# EAGLE schematic cell (EAGLE 7.6.0)
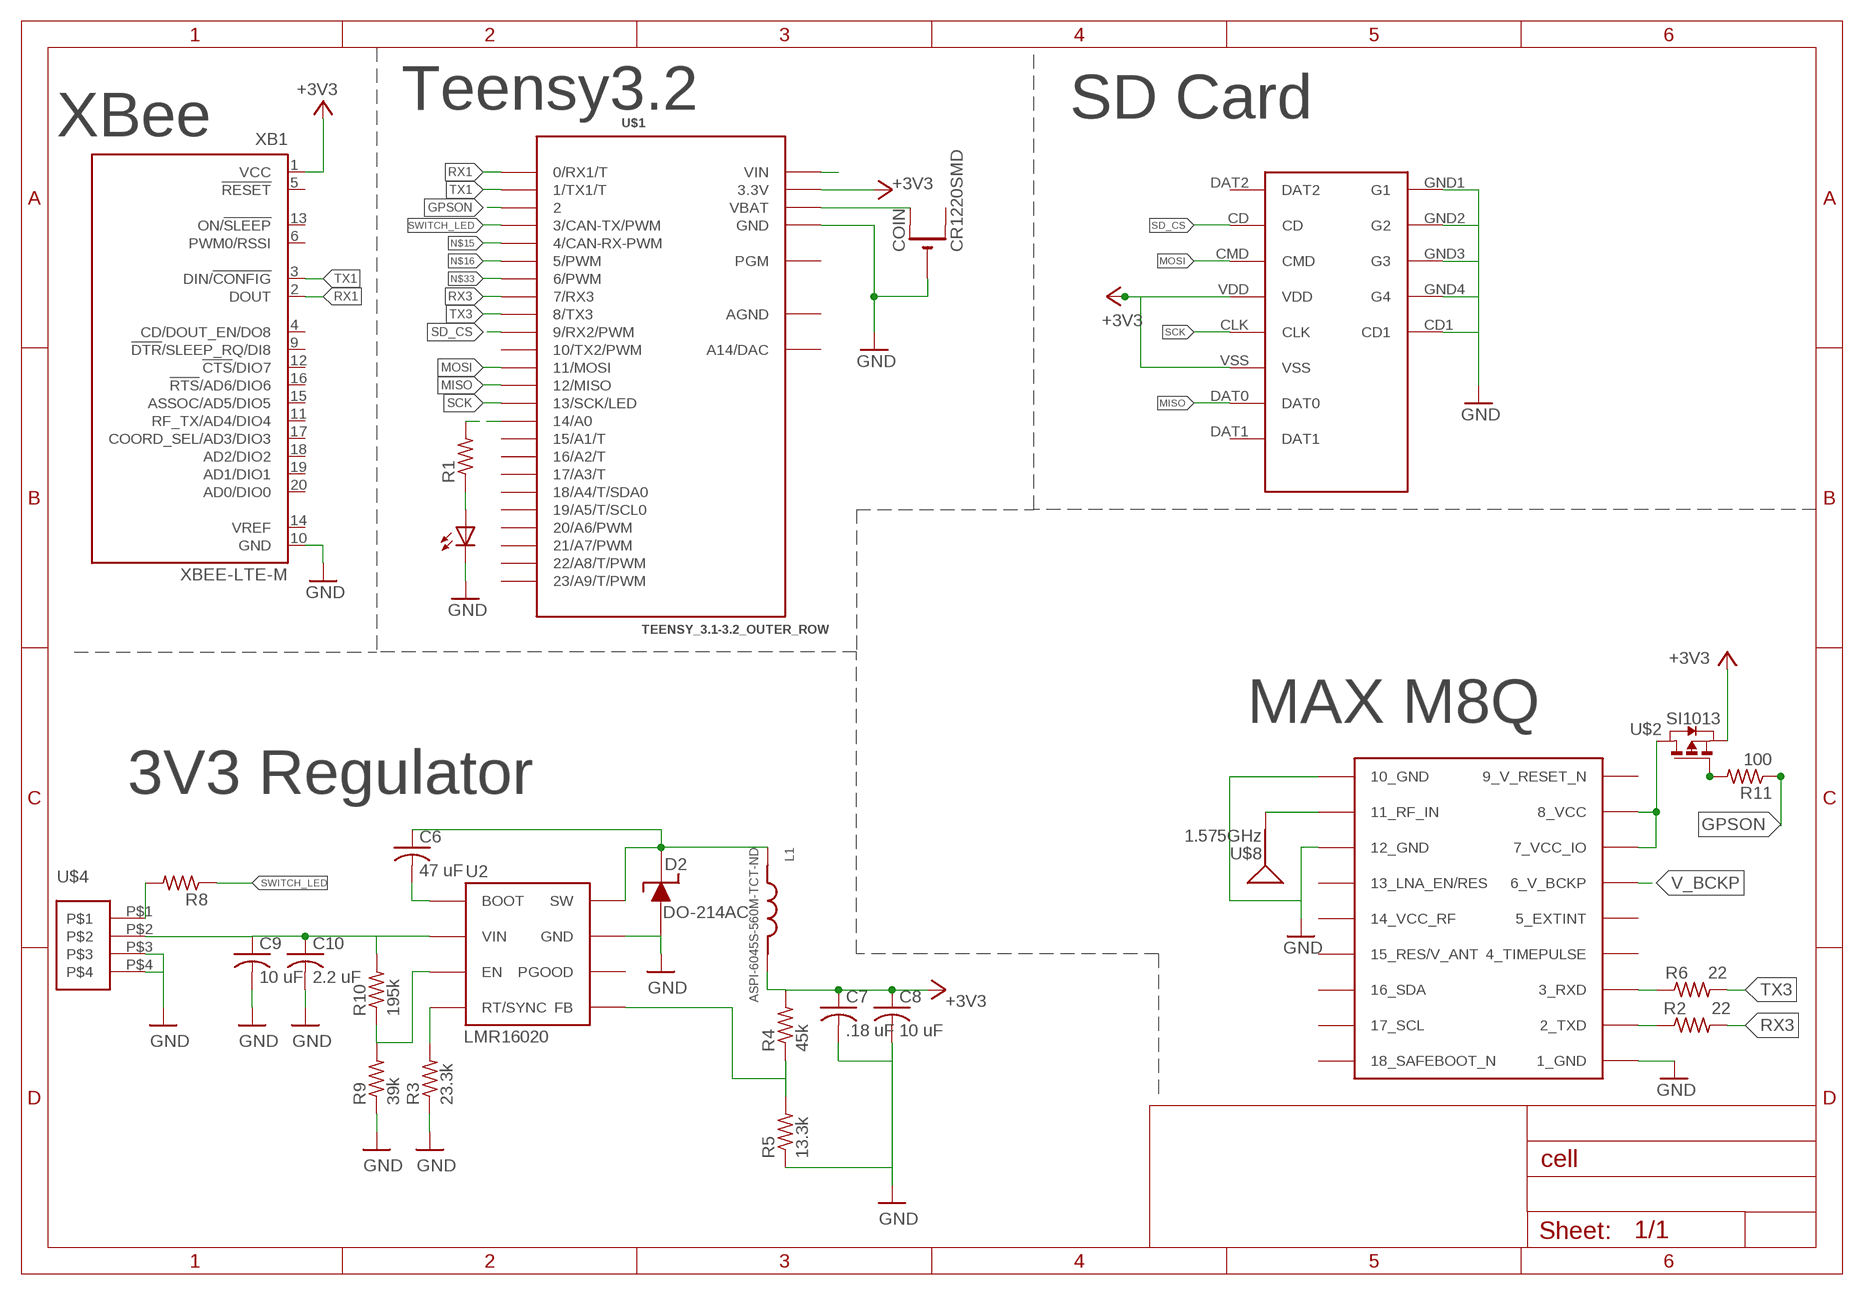
[diagram p0: schematic, sheet 1]

## Parts
C6  47 uF  C-USC0805  [C0805]
C7  .18 uF  C-USC0603  [C0603]
C8  10 uF  C-USC0603  [C0603]
C9  10 uF  C-USC1210  [C1210]
C10  2.2 uF  C-USC1210  [C1210]
COIN  CR1220SMD  CR1220SMT  [CR1220-SMD]
D2  DO-214AC  [DO-214AC]
L1  ASPI-6045S-560M-TCT-ND  [ABRACON]
LED1  Green  LEDCHIP-LED0603  [CHIP-LED0603]
R1  470  R-US_R0603  [R0603]
R2  22  R-US_R0603  [R0603]
R3  23.3k  R-US_R0603  [R0603]
R4  45k  R-US_R0603  [R0603]
R5  13.3k  R-US_R0603  [R0603]
R6  22  R-US_R0603  [R0603]
R8  R-US_R0603  [R0603]
R9  39k  R-US_R0603  [R0603]
R10  195k  R-US_R0603  [R0603]
R11  100  R-US_R0603  [R0603]
U2  LMR16020  [SO8]
U$1  TEENSY_3.1-3.2_OUTER_ROW  [TEENSY_3.0-3.2&LC_OUTER_ROW]
U$2  SI1013  [SC-75]
U$3  MICRO_SD  [MICRO_SD_HINGED]
U$4  MICROCLASP_4  [4_PIN_MICROCLASP]
U$7  MAX-M8  [MAX-M8]
U$8  1.575GHz  SPARKFUN-GPS_ANTENNAGPS-2X7MM  [SPARKFUN-GPS_ANT-GPS-2X7MM]
XB1  XBEE-LTE-M  XBEE-PRO  [XBEE-PRO]

## Nets
+3V3: C7.1 C8.1 L1.P$2 R4.2 U$1.3.3V U$1.3.3V1(3.3V) U$2.P$2(S) U$3.VDD U$3.VSS XB1.1(VCC)
EN: R9.2 R10.1 U2.P$3(EN)
FB: R4.1 R5.2 U2.P$5(FB)
GND: C7.2 C8.2 C9.2 C10.2 COIN.- D2.P$1 LED1.C R3.1 R5.1 R9.1 U2.P$7(GND) U2.PAD(GND) U$1.GND U$1.GND1(GND) U$3.CD1 U$3.GND1(G1) U$3.GND2(G2) U$3.GND3(G3) U$3.GND4(G4) U$4.P$3 U$4.P$4 U$7.1_GND U$7.10_GND U$7.12_GND XB1.10(GND)
GPSON: R11.1 U$1.2
MISO: U$1.12(12/MISO) U$3.DAT0
MOSI: U$1.11(11/MOSI) U$3.CMD
N$1: U$7.11_RF_IN U$8.1(SIGNAL)
N$2: R1.2 U$1.14/A0
N$3: R6.1 U$7.3_RXD
N$4: R2.1 U$7.2_TXD
N$5: R11.2 U$2.P$1(G)
N$6: U$1.VIN
N$8: R3.2 U2.P$4(RT/SYNC)
N$9: C6.2 U2.P$1(BOOT)
N$10: LED1.A R1.1
N$11: U$2.P$3(D) U$7.7_VCC_IO U$7.8_VCC
N$12: R8.2 U$4.P$1
N$15: U$1.4(4/CAN-RX-PWM)
N$16: U$1.5(5/PWM)
N$33: U$1.6(6/PWM)
RX1: U$1.0(0/RX1/T) XB1.2(DOUT)
RX3: R2.2 U$1.7(7/RX3)
SCK: U$1.13(13/SCK/LED) U$3.CLK
SD_CS: U$1.9(9/RX2/PWM) U$3.CD
SW: C6.1 D2.P$2 L1.P$1 U2.P$8(SW)
SWITCH_LED: R8.1 U$1.3(3/CAN-TX/PWM)
TX1: U$1.1(1/TX1/T) XB1.3(DIN/!CONFIG)
TX3: R6.2 U$1.8(8/TX3)
V_BCKP: COIN.+$1(+) U$1.VBAT U$7.6_V_BCKP
VIN: C9.1 C10.1 R10.2 U2.P$2(VIN) U$4.P$2
Unconnected: COIN.+$2(+1) U2.P$6(PGOOD) U$1.10(10/TX2/PWM) U$1.15/A1(15/A1/T) U$1.16/A2(16/A2/T) U$1.17/A3(17/A3/T) U$1.18/A4(18/A4/T/SDA0) U$1.19/A5(19/A5/T/SCL0) U$1.20/A6(20/A6/PWM) U$1.21/A7(21/A7/PWM) U$1.22/A8(22/A8/T/PWM) U$1.23/A9(23/A9/T/PWM) U$1.PGM U$1.RESET/DAC(A14/DAC) U$3.DAT1 U$3.DAT2 U$7.4_TIMEPULSE U$7.5_EXTINT U$7.13_LNA_EN(13_LNA_EN/RES) U$7.14_VCC_RF U$7.15_V_ANT/RESERVED(15_RES/V_ANT) U$7.16_SDA U$7.17_SCL U$7.18_SAFEBOOT_N XB1.4(CD/DOUT_EN/DO8) XB1.5(!RESET) XB1.6(PWM0/RSSI) XB1.9(!DTR!/SLEEP_RQ/DI8) XB1.11(RF_TX/AD4/DIO4) XB1.12(!CTS!/DIO7) XB1.13(ON/!SLEEP) XB1.14(VREF) XB1.15(ASSOC/AD5/DIO5) XB1.16(!RTS!/AD6/DIO6) XB1.17(COORD_SEL/AD3/DIO3) XB1.18(AD2/DIO2) XB1.19(AD1/DIO1) XB1.20(AD0/DIO0)

## Notes on the sheet
- Teensy3.2 | SD Card
- XBee
- MAX M8Q
- 3V3 Regulator

## Power pins joined to a net without a drawn wire
9_V_RESET_N: U$7.9_RESET_N(9_V_RESET_N)
AGND: U$1.AGND

## Library data of the parts
C6-C10 = resistor:C-US: CAPACITOR, American symbol
COIN = adafruit:CR1220: CR1216/CR1220/CR1225 12mm 3V lithium coin cell Great for battery packup. Both SMT and THM holders. Note the THM package has the ground pads on both sides of the PCB so that the masks are the same - this reduces the cost
D2 = HASP:DO-214AC
L1 = inductors:ASPI-6045S-560M-TCT-ND
LED1 = led:LED: LED OSRAM: - CHIPLED LG R971, LG N971, LY N971, LG Q971, LY Q971, LO R971, LY R971 LH N974, LH R974 LS Q976, LO Q976, LY Q976 LO Q996 - Hyper CHIPLED LW Q18S LB Q993, LB Q99A, LB R99A - SideLED LS A670, LO A670, LY A670, LG A670, LP A670 LB A673, LV A673, LT A673, LW A673 LH A674 LY A675 LS A676, LA A676, LO A676, LY A676, LW A676 LS A679, LY A679, LG A679 - Hyper Micro SIDELED® LS Y876, LA Y876, LO Y876, LY Y876 LT Y87S - SmartLED LW L88C, LW L88S LB L89C, LB L89S, LG L890 LS L89K, LO L89K, LY L89K LS L896, LA L896, LO L896, LY L896 - TOPLED LS T670, LO T670, LY T670, LG T670, LP T670 LSG T670, LSP T670, LSY T670, LOP T670, LYG T670 LG T671, LOG T671, LSG T671 LB T673, LV T673, LT T673, LW T673 LH T674 LS T676, LA T676, LO T676, LY T676, LB T676, LH T676, LSB T676, LW T676 LB T67C, LV T67C, LT T67C, LS T67K, LO T67K, LY T67K, LW E67C LS E67B, LA E67B, LO E67B, LY E67B, LB E67C, LV E67C, LT E67C LW T67C LS T679, LY T679, LG T679 LS T770, LO T770, LY T770, LG T770, LP T770 LB T773, LV T773, LT T773, LW T773 LH T774 LS E675, LA E675, LY E675, LS T675 LS T776, LA T776, LO T776, LY T776, LB T776 LHGB T686 LT T68C, LB T68C - Hyper Mini TOPLED® LB M676 - Mini TOPLED Santana® LG M470 LS M47K, LO M47K, LY M47K Source: http://www.osram.convergy.de LUXEON: - LUMILED® LXK2-PW12-R00, LXK2-PW12-S00, LXK2-PW14-U00, LXK2-PW14-V00 LXK2-PM12-R00, LXK2-PM12-S00, LXK2-PM14-U00 LXK2-PE12-Q00, LXK2-PE12-R00, LXK2-PE12-S00, LXK2-PE14-T00, LXK2-PE14-U00 LXK2-PB12-K00, LXK2-PB12-L00, LXK2-PB12-M00, LXK2-PB14-N00, LXK2-PB14-P00, LXK2-PB14-Q00 LXK2-PR12-L00, LXK2-PR12-M00, LXK2-PR14-Q00, LXK2-PR14-R00 LXK2-PD12-Q00, LXK2-PD12-R00, LXK2-PD12-S00 LXK2-PH12-R00, LXK2-PH12-S00 LXK2-PL12-P00, LXK2-PL12-Q00, LXK2-PL12-R00 Source: www.luxeon.com KINGBRIGHT: KA-3528ASYC Source: www.kingbright.com
R1 R3-R5 R8-R10 = resistor:R-US_: RESISTOR, American symbol
R2 R6 R11 = rcl:R-US_: RESISTOR, American symbol
U2 = HASP:LMR16020
U$1 = Teensy_3_and_LC_Series_Boards_v1.4:TEENSY_3.1-3.2_OUTER_ROW: Footprint for Teensy 3.1 or 3.2 board using all pin connections on the outer perimeter
U$2 = cmdLibs:SI1013: A PMOS that can be found in LTSPICE
U$3 = NR_connectors:MICRO_SD
U$4 = NR_connectors:MICROCLASP_4
U$7 = ubloxLib:MAX-M8: u-blox MAX GNSS module
U$8 = Tracksoar v2 :SPARKFUN-GPS_ANTENNA: Single-ended Antennae 1.575GHz antennae with just one terminal. These are all chip antennae. 1575MHz (GPS) Antennae ANT-GPS-2X7MM - 2.0 x 7.0 mm chip antenna. (SparkFun Product <https://www.sparkfun.com/products/9131>) ANT-GPS-2X8MM - 2.0 x 8.0 mm chip antenna. (SparkFun Product <https://www.sparkfun.com/products/8418>); PROD_ID: ANT-09087; SF_ID: GPS-09131
XB1 = maxstream:XBEE: XBee (TM) /XBee-PRO(TM) OEM RF Modules Source: MaxStream, Inc. xbee_productmanual.pdf; MPN: XBP24-AWI-001; OC_FARNELL: 1337916; OC_NEWARK: 42M2667